# Altium schematic sheet Input_dig.SchDoc
size A4
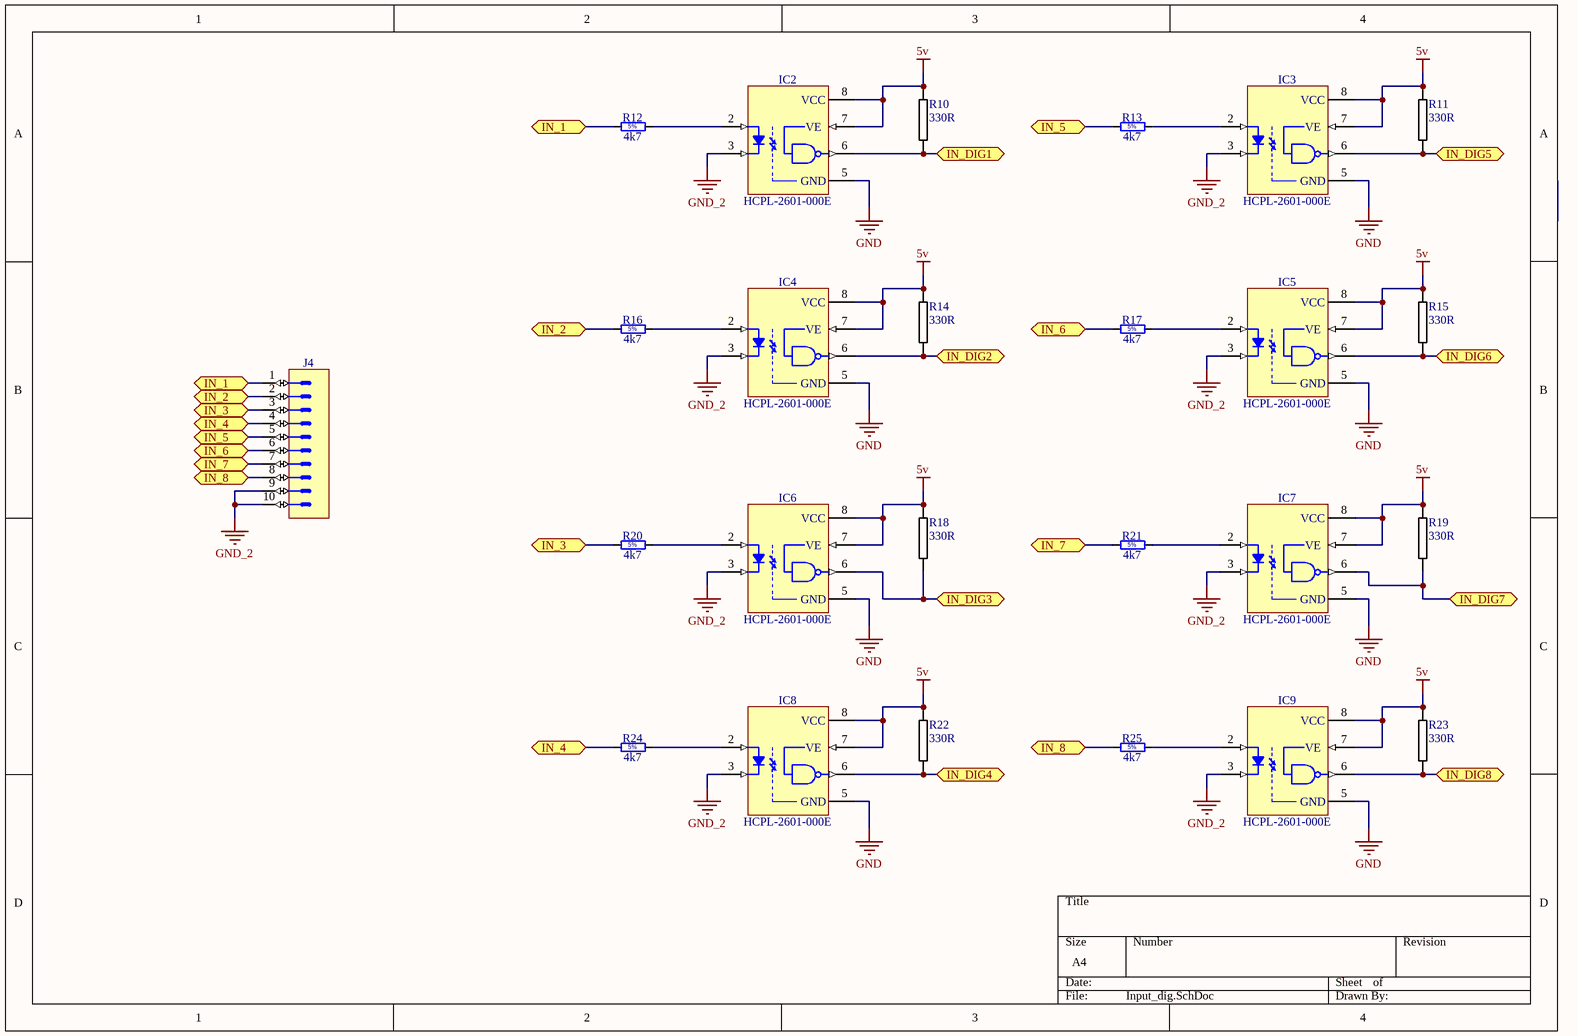
[diagram p0: Input_dig.SchDoc]

## Parts
IC2  HCPL-2601-000E  [DIP8-300]
IC3  HCPL-2601-000E  [DIP8-300]
IC4  HCPL-2601-000E  [DIP8-300]
IC5  HCPL-2601-000E  [DIP8-300]
IC6  HCPL-2601-000E  [DIP8-300]
IC7  HCPL-2601-000E  [DIP8-300]
IC8  HCPL-2601-000E  [DIP8-300]
IC9  HCPL-2601-000E  [DIP8-300]
J4  (no value)  [PHOENIX_1757323]
R10  330R  [0805R-330]
R11  330R  [0805R-330]
R12  4k7  [RES2286-1670X520]
R13  4k7  [RES2286-1670X520]
R14  330R  [0805R-330]
R15  330R  [0805R-330]
R16  4k7  [RES2286-1670X520]
R17  4k7  [RES2286-1670X520]
R18  330R  [0805R-330]
R19  330R  [0805R-330]
R20  4k7  [RES2286-1670X520]
R21  4k7  [RES2286-1670X520]
R22  330R  [0805R-330]
R23  330R  [0805R-330]
R24  4k7  [RES2286-1670X520]
R25  4k7  [RES2286-1670X520]

## Ports
IN_1, IN_2, IN_3, IN_4, IN_5, IN_6, IN_7, IN_8, IN_DIG1, IN_DIG2, IN_DIG3, IN_DIG4, IN_DIG5, IN_DIG6, IN_DIG7, IN_DIG8

## Nets
5v: IC2.7(VE) IC2.8(VCC) IC3.7(VE) IC3.8(VCC) IC4.7(VE) IC4.8(VCC) IC5.7(VE) IC5.8(VCC) IC6.7(VE) IC6.8(VCC) IC7.7(VE) IC7.8(VCC) IC8.7(VE) IC8.8(VCC) IC9.7(VE) IC9.8(VCC) R10.1 R11.1 R14.1 R15.1 R18.1 R19.1 R22.1 R23.1
GND: IC2.5(GND) IC3.5(GND) IC4.5(GND) IC5.5(GND) IC6.5(GND) IC7.5(GND) IC8.5(GND) IC9.5(GND)
GND_2: IC2.3(K) IC3.3(K) IC4.3(K) IC5.3(K) IC6.3(K) IC7.3(K) IC8.3(K) IC9.3(K) J4.9 J4.10
IN_1: J4.1 R12.1 ; port IN_1
IN_2: J4.2 R16.1 ; port IN_2
IN_3: J4.3 R20.1 ; port IN_3
IN_4: J4.4 R24.1 ; port IN_4
IN_5: J4.5 R13.1 ; port IN_5
IN_6: J4.6 R17.1 ; port IN_6
IN_7: J4.7 R21.1 ; port IN_7
IN_8: J4.8 R25.1 ; port IN_8
IN_DIG1: IC2.6(VO) R10.2 ; port IN_DIG1
IN_DIG2: IC4.6(VO) R14.2 ; port IN_DIG2
IN_DIG3: IC6.6(VO) R18.2 ; port IN_DIG3
IN_DIG4: IC8.6(VO) R22.2 ; port IN_DIG4
IN_DIG5: IC3.6(VO) R11.2 ; port IN_DIG5
IN_DIG6: IC5.6(VO) R15.2 ; port IN_DIG6
IN_DIG7: IC7.6(VO) R19.2 ; port IN_DIG7
IN_DIG8: IC9.6(VO) R23.2 ; port IN_DIG8
NetIC2_2: IC2.2(A) R12.2
NetIC3_2: IC3.2(A) R13.2
NetIC4_2: IC4.2(A) R16.2
NetIC5_2: IC5.2(A) R17.2
NetIC6_2: IC6.2(A) R20.2
NetIC7_2: IC7.2(A) R21.2
NetIC8_2: IC8.2(A) R24.2
NetIC9_2: IC9.2(A) R25.2

## Notes on the sheet
- (in symbol RMF_4K7_5%_3W_250PPM_2286-1670X520) 5%

## Library data of the parts
IC2-IC9 = HCPL-2601-000E: Single Optocoupler; Part Description: High CMR, High Speed TTL Compatible Optocouplers; Manufacturer: AVAGO TECHNOLOGIES; Table: Optocouplers; Part Number: HCPL-2601-000E; Component Kind: Standard; Component Type: Standard; Device: HCPL-2601-000E; PackageDescription: DIP; 8 Leads; Row Spacing 7.62 mm; Pitch 2.54 mm; Manufacturer Part Number: HCPL-2601-000E; Pin Count: 8; Case: DIP8-300; Mounted: Yes; Socket: Yes; SMD: No; ComponentHeight: 4.7mm; HelpURL: \\cern.ch\dfs\Applications\Altium\Datasheets\HCPL-2601-000E.pdf; Author: CERN DEM JLC; CreateDate: 30/03/2009; LatestRevisionDate: 30/03/2009
J4 = PHOENIX_1757323: Connector 10 Male; Part Description: 12A, 250V, Pitch 5.08mm, 10 Positions Header; Manufacturer: PHOENIX CONTACT; Manufacturer Part Number: 1757323 (MSTBA 2,5/ 10-G-5,08); Part Number: PHOENIX_1757323; Component Kind: Standard; Component Type: Standard; Pin Count: 10; Mounted: Yes; Socket: No; SMD: No; Status: None; ComponentHeight: 8.6mm; HelpURL: \\cern.ch\dfs\Applications\Altium\Datasheets\PHOENIX_1757323.pdf; Author: CERN DEM JLC; CreateDate: 10/02/2010; LatestRevisionDate: 26/04/2010; Table: PHOENIX
R10 R11 R14 R15 R18 R19 R22 R23 = 0805R-330: RESISTOR 0805 1/4 WATT THIN FILM; Reel: *
R12 R13 R16 R17 R20 R21 R24 R25 = RMF_4K7_5%_3W_250PPM_2286-1670X520: Resistor - 5%; Part Description: Leaded Power Metal Film Resistor; Manufacturer: GENERIC; Manufacturer1 Part Number: PR03000204701JAC00; Power: 3W; TC: ±250ppm/°C; Table: Resistors THD; Part Number: RMF_4K7_5%_3W_250PPM_2286-1670X520; Component Kind: Standard; Component Type: Standard; Pin Count: 2; Value: 4k7; Status: Preferred; Tolerance: ±5%; Manufacturer Part Number: RMF_4K7_5%_3W_250PPM_2286-1670X520; Case: LS22.86 L16.7 x D5.2; Mounted: Yes; Socket: No; SMD: No; ComponentHeight: 5.2mm; Manufacturer1 Example: VISHAY BCCOMPONENT; Manufacturer1 ComponentHeight: 5.2mm; HelpURL: \\cern.ch\dfs\Applications\Altium\Datasheets\RMF_VISHAY_PR03.pdf; Author: CERN DEM JLC; CreateDate: 19/06/2008; LatestRevisionDate: 01/10/2012